# EasyEDA Pro project LisaFPGA Rev 2 EasyEDA Project.epro, schematic LisaFPGA Schematic, sheet 1 of 8

## Sheets
1 Power and USB Input: Board Name: LisaFPGA; Create Date: 2025-10-14; Page Name: Power and USB Input; Project Name: LisaFPGA; Schematic Name: LisaFPGA Schematic; Update Date: 2026-01-04; Company: EasyEDA.com; Page Size: A4; Version: V1.0
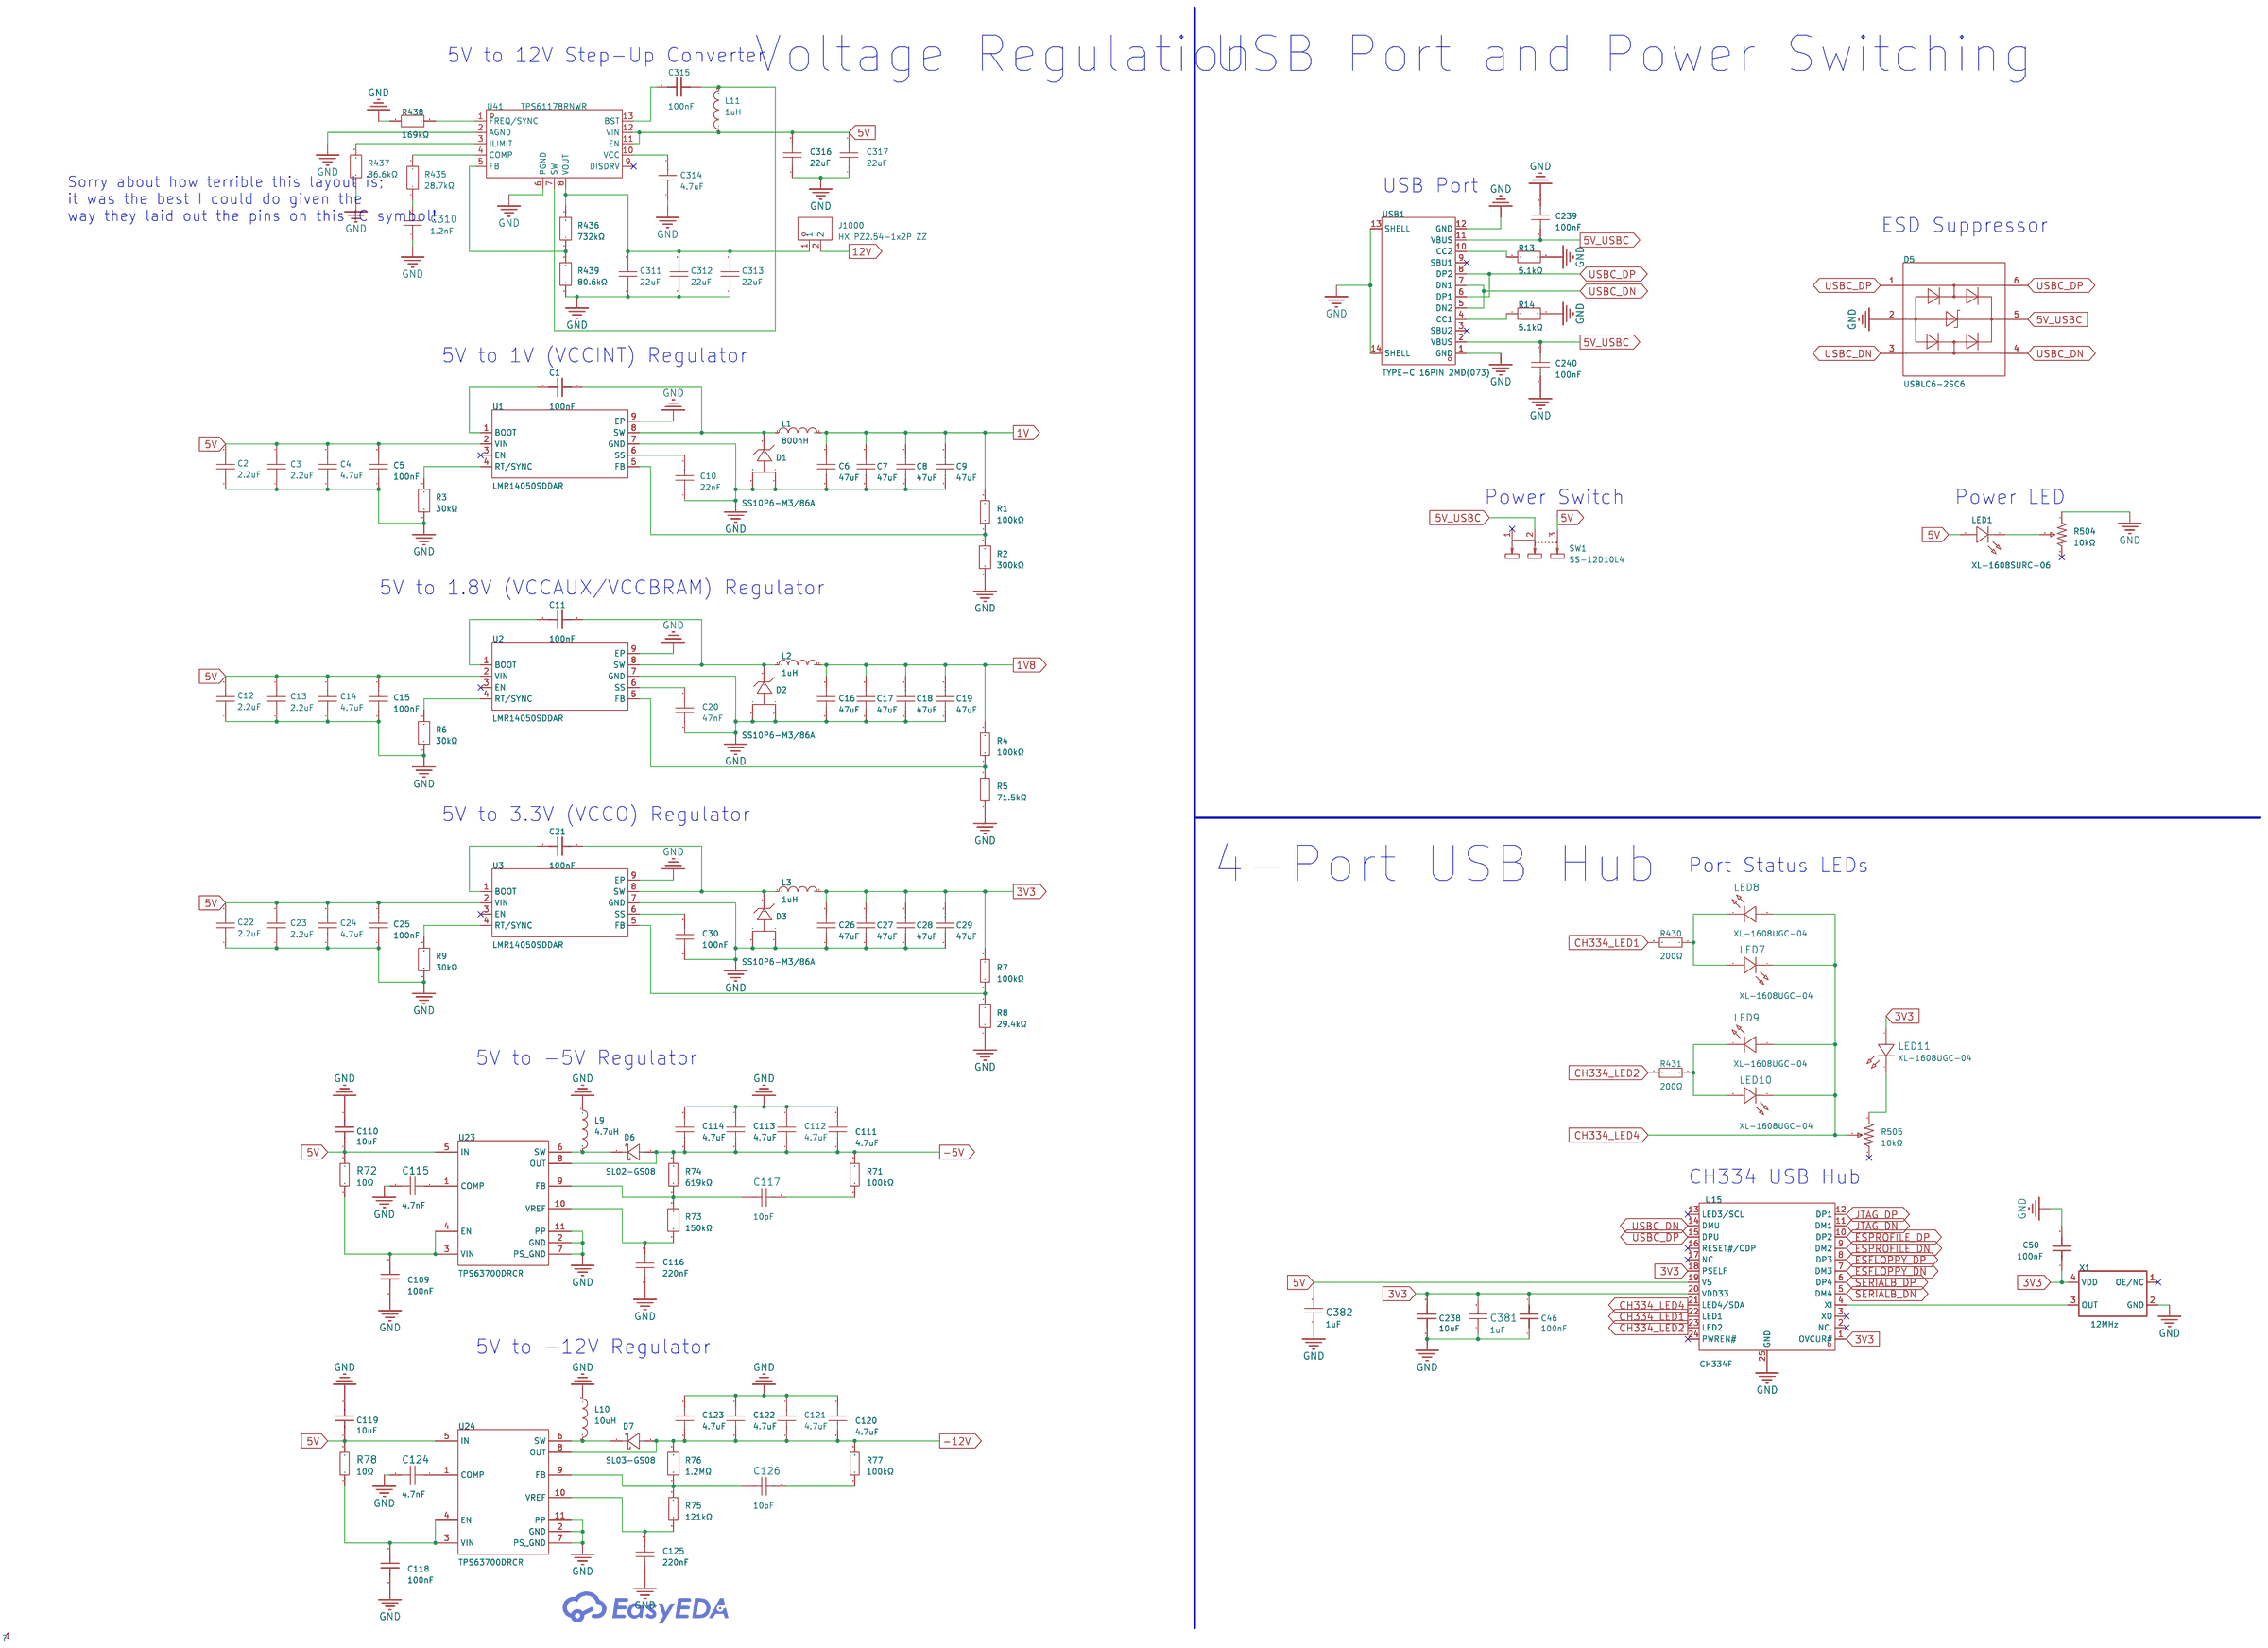
[diagram p1: Power and USB Input]

## Parts
C1  100nF  [C0402]
C2  2.2uF  [C1206]
C3  2.2uF  [C1206]
C4  4.7uF  [C0603]
C5  100nF  [C0805]
C6  47uF  [C1210]
C7  47uF  [C1210]
C8  47uF  [C1210]
C9  47uF  [C1210]
C10  22nF  [C0603]
C11  100nF  [C0402]
C12  2.2uF  [C1206]
C13  2.2uF  [C1206]
C14  4.7uF  [C0603]
C15  100nF  [C0805]
C16  47uF  [C1210]
C17  47uF  [C1210]
C18  47uF  [C1210]
C19  47uF  [C1210]
C20  47nF  [C0603]
C21  100nF  [C0402]
C22  2.2uF  [C1206]
C23  2.2uF  [C1206]
C24  4.7uF  [C0603]
C25  100nF  [C0805]
C26  47uF  [C1210]
C27  47uF  [C1210]
C28  47uF  [C1210]
C29  47uF  [C1210]
C30  100nF  [C0805]
C46  100nF  [C0402]
C50  100nF  [C0402]
C109  100nF  [C0402]
C110  10uF  [C0603]
C111  4.7uF  [C0603]
C112  4.7uF  [C0603]
C113  4.7uF  [C0603]
C114  4.7uF  [C0603]
C115  4.7nF  [C0402]
C116  220nF  [C0402]
C117  10pF  [C0402]
C118  100nF  [C0402]
C119  10uF  [C0603]
C120  4.7uF  [C0603]
C121  4.7uF  [C0603]
C122  4.7uF  [C0603]
C123  4.7uF  [C0603]
C124  4.7nF  [C0402]
C125  220nF  [C0402]
C126  10pF  [C0402]
C238  10uF  [C0603]
C239  100nF  [C0805]
C240  100nF  [C0805]
C310  1.2nF  [C0402]
C311  22uF  [C0805]
C312  22uF  [C0805]
C313  22uF  [C0805]
C314  4.7uF  [C0603]
C315  100nF  [C0402]
C316  22uF  [C0805]
C317  22uF  [C0805]
C381  1uF  [C0402]
C382  1uF  [C0402]
D1  SS10P6-M3/86A  [TO-277A_L6.1-W4.6-P2.13-LS6.5-TR]
D2  SS10P6-M3/86A  [TO-277A_L6.1-W4.6-P2.13-LS6.5-TR]
D3  SS10P6-M3/86A  [TO-277A_L6.1-W4.6-P2.13-LS6.5-TR]
D5  USBLC6-2SC6  [SOT-23-6_L2.9-W1.6-P0.95-LS2.8-BL]
D6  SL02-GS08  [SOD-123_L2.7-W1.8-LS3.7-RD]
D7  SL03-GS08  [SMF_L2.8-W1.8-LS3.7-RD]
J1000  HX PZ2.54-1x2P ZZ  [HDR-TH_2P-P2.54-V-M-3]
L1  800nH  [IND-SMD_L11.5-W10.0_FXL1040]
L2  1uH  [IND-SMD_L7.0-W6.6]
L3  1uH  [IND-SMD_L7.0-W6.6]
L9  4.7uH  [IND-SMD_L4.5-W4.2]
L10  10uH  [IND-SMD_L4.0-W4.0_FNR40XXS]
L11  1uH  [IND-SMD_L7.0-W6.6]
LED1  XL-1608SURC-06  [LED0603-RD_RED]
LED7  XL-1608UGC-04  [LED0603-RD_GREEN]
LED8  XL-1608UGC-04  [LED0603-RD_GREEN]
LED9  XL-1608UGC-04  [LED0603-RD_GREEN]
LED10  XL-1608UGC-04  [LED0603-RD_GREEN]
LED11  XL-1608UGC-04  [LED0603-RD_GREEN]
R1  100kΩ  [R0603]
R2  300kΩ  [R0603]
R3  30kΩ  [R0603]
R4  100kΩ  [R0603]
R5  71.5kΩ  [R0603]
R6  30kΩ  [R0603]
R7  100kΩ  [R0603]
R8  29.4kΩ  [R0603]
R9  30kΩ  [R0603]
R13  5.1kΩ  [R0603]
R14  5.1kΩ  [R0603]
R71  100kΩ  [R0603]
R72  10Ω  [R0603]
R73  150kΩ  [R0402]
R74  619kΩ  [R0402]
R75  121kΩ  [R0402]
R76  1.2MΩ  [R0402]
R77  100kΩ  [R0603]
R78  10Ω  [R0603]
R430  200Ω  [R0402]
R431  200Ω  [R0402]
R435  28.7kΩ  [R0402]
R436  732kΩ  [R0603]
R437  86.6kΩ  [R0402]
R438  169kΩ  [R0402]
R439  80.6kΩ  [R0603]
R504  10kΩ  [RES-ADJ-SMD_3P-L3.0-W3.8-P1.75-BR]
R505  10kΩ  [RES-ADJ-SMD_3P-L3.0-W3.8-P1.75-BR]
SW1  SS-12D10L4  [SW-TH_SS-12D10L3]
U1  LMR14050SDDAR  [SOIC-8_L4.9-W3.9-P1.27-LS6.0-BL-EP]
U2  LMR14050SDDAR  [SOIC-8_L4.9-W3.9-P1.27-LS6.0-BL-EP]
U3  LMR14050SDDAR  [SOIC-8_L4.9-W3.9-P1.27-LS6.0-BL-EP]
U15  CH334F  [QFN-24_L4.0-W4.0-P0.50-BL-EP2.8]
U23  TPS63700DRCR  [VSON-10_L3.0-W3.0-P0.50-TL-EP]
U24  TPS63700DRCR  [VSON-10_L3.0-W3.0-P0.50-TL-EP]
U41  TPS61178RNWR  [VQFN-HR-13_L3.0-W3.5-P0.50-BL]
USB1  TYPE-C 16PIN 2MD(073)  [USB-C-SMD_TYPE-C-6PIN-2MD-073]
X1  12MHz  [OSC-SMD_4P-L3.2-W2.5-BL]

## Library data of the parts
C1 C11 C21 C46 C50 C109 C118 C315 = 100nF: Supplier: LCSC; Supplier Part: C343042; Manufacturer: TDK; Manufacturer Part: CGA2B3X7R1H104KT0Y0F; JLCPCB Part Class: Extended Part; nameAlias: Value; Contributor: LCSC; spicePre: C; spiceSymbolName: CGA2B3X7R1H104KT0Y0F
C2 C3 C12 C13 C22 C23 = CL31B225KCHSNNE: Capacitance:2.2uF Tolerance:±10% Tolerance:±10% Voltage Rating:100V Temperature Coefficient:X7R; LCSC Part Name: 2.2uF ±10% 100V; Supplier Part: C170101; Manufacturer: SAMSUNG(三星); Supplier Footprint: 1206; JLCPCB Part Class: Extended Part; Datasheet: https://item.szlcsc.com/datasheet/CL31B225KCHSNNE/181486.html; Supplier: LCSC; Tolerance: ±10%; Voltage Rating: 100V; Temperature Coefficient: X7R
C4 C14 C24 C111-C114 C120-C123 C314 = CL10A475KO8NNNC: Capacitance:4.7uF Tolerance:±10% Tolerance:±10% Voltage Rating:16V Temperature Coefficient:X5R; LCSC Part Name: 4.7uF ±10% 16V; Supplier Part: C19666; Manufacturer: SAMSUNG(三星); Supplier Footprint: 0603; JLCPCB Part Class: Basic Part; Datasheet: https://item.szlcsc.com/datasheet/CL10A475KO8NNNC/20375.html; Supplier: LCSC; Tolerance: ±10%; Voltage Rating: 16V; Temperature Coefficient: X5R
C5 C15 C25 C30 C239 C240 = C0805B104K500NT: Capacitance:100nF Tolerance:±10% Tolerance:±10% Voltage Rating:50V Temperature Coefficient:X7R; LCSC Part Name: 100nF ±10% 50V; Supplier Part: C476766; Manufacturer: TORCH(火炬); Supplier Footprint: 0805; JLCPCB Part Class: Extended Part; Datasheet: https://item.szlcsc.com/datasheet/C0805B104K500NT/483556.html; Supplier: LCSC; Tolerance: ±10%; Voltage Rating: 50V; Temperature Coefficient: X7R
C6-C9 C16-C19 C26-C29 = CS3225X7R476K160NRL: Capacitance:47uF Tolerance:±10% Tolerance:±10% Voltage Rating:16V Temperature Coefficient:X7R; LCSC Part Name: 47uF ±10% 16V; Supplier Part: C5440143; Manufacturer: SAMWHA(三和); Supplier Footprint: 1210; JLCPCB Part Class: Extended Part; Datasheet: https://atta.szlcsc.com/upload/public/pdf/source/20241120/90C342CED6A4517481676783052A38A7.pdf; Supplier: LCSC; Tolerance: ±10%; Voltage Rating: 16V; Temperature Coefficient: X7R
C10 = CGA3E3X8R2A223KT0Y0N: Capacitance:22nF Tolerance:±10% Tolerance:±10% Voltage Rating:100V Temperature Coefficient:X8R; LCSC Part Name: 22nF ±10% 100V; Supplier Part: C5139510; Manufacturer: TDK; Supplier Footprint: 0603; JLCPCB Part Class: Extended Part; Datasheet: https://item.szlcsc.com/datasheet/CGA3E3X8R2A223KT0Y0N/5751593.html; Supplier: LCSC; Tolerance: ±10%; Voltage Rating: 100V; Temperature Coefficient: X8R
C20 = TCC0603X7R473M500CT: Capacitance:47nF Tolerance:±20% Tolerance:±20% Voltage Rating:50V Temperature Coefficient:X7R; LCSC Part Name: 47nF ±20% 50V; Supplier Part: C696860; Manufacturer: CCTC(三环); Supplier Footprint: 0603; JLCPCB Part Class: Extended Part; Datasheet: https://item.szlcsc.com/datasheet/TCC0603X7R473M500CT/730944.html; Supplier: LCSC; Tolerance: ±20%; Voltage Rating: 50V; Temperature Coefficient: X7R
C110 C119 C238 = 10uF: Supplier: LCSC; Supplier Part: C2936601; Manufacturer: YAGEO(国巨); Manufacturer Part: CC0603KRX5R7BB106; JLCPCB Part Class: Extended Part; nameAlias: Value; Contributor: lcsc; spicePre: C; spiceSymbolName: CC0603KRX5R7BB106
C115 C124 = CL05B472KB5NNNC: Capacitance:4.7nF Tolerance:±10% Tolerance:±10% Voltage Rating:50V Temperature Coefficient:X7R; LCSC Part Name: 4.7nF ±10% 50V; Supplier Part: C84705; Manufacturer: SAMSUNG(三星); Supplier Footprint: 0402; JLCPCB Part Class: Extended Part; Datasheet: https://item.szlcsc.com/datasheet/CL05B472KB5NNNC/85876.html; Supplier: LCSC; Tolerance: ±10%; Voltage Rating: 50V; Temperature Coefficient: X7R
C116 C125 = 0402X224K250NT: Capacitance:220nF Tolerance:±10% Tolerance:±10% Voltage Rating:25V Temperature Coefficient:X5R; LCSC Part Name: 220nF ±10% 25V; Supplier Part: C2991751; Manufacturer: FH(风华); Supplier Footprint: 0402; JLCPCB Part Class: Extended Part; Datasheet: https://atta.szlcsc.com/upload/public/pdf/source/20200305/C486355_26A10D38EF8C2A5C37091D0039909270.pdf; Supplier: LCSC; Tolerance: ±10%; Voltage Rating: 25V; Temperature Coefficient: X5R
C117 C126 = TCC0402COG100J500AT: Capacitance:10pF Tolerance:±5% Tolerance:±5% Voltage Rating:50V Temperature Coefficient:C0G; LCSC Part Name: 10pF ±5% 50V; Supplier Part: C696913; Manufacturer: CCTC(三环); Supplier Footprint: 0402; JLCPCB Part Class: Extended Part; Datasheet: https://item.szlcsc.com/datasheet/TCC0402COG100J500AT/730997.html; Supplier: LCSC; Tolerance: ±5%; Voltage Rating: 50V; Temperature Coefficient: C0G
C310 = CC0402KRX7R9BB122: Capacitance:1.2nF Tolerance:±10% Tolerance:±10% Voltage Rating:50V Temperature Coefficient:X7R; LCSC Part Name: 1.2nF ±10% 50V; Supplier Part: C107021; Manufacturer: YAGEO(国巨); Supplier Footprint: 0402; JLCPCB Part Class: Extended Part; Datasheet: https://item.szlcsc.com/datasheet/CC0402KRX7R9BB122/108237.html; Supplier: LCSC; Tolerance: ±10%; Voltage Rating: 50V; Temperature Coefficient: X7R
C311-C313 C316 C317 = CL21A226MAYNNNE: Capacitance:22uF Tolerance:±20% Tolerance:±20% Voltage Rating:25V Temperature Coefficient:X5R; LCSC Part Name: 22uF ±20% 25V; Supplier Part: C602037; Manufacturer: SAMSUNG(三星); Supplier Footprint: 0805; JLCPCB Part Class: Extended Part; Datasheet: https://item.szlcsc.com/datasheet/CL21A226MAYNNNE/631473.html; Supplier: LCSC; Tolerance: ±20%; Voltage Rating: 25V; Temperature Coefficient: X5R
C381 C382 = CL05A105KO5NNNC: Capacitance:1uF Tolerance:±10% Tolerance:±10% Voltage Rating:16V Temperature Coefficient:X5R; LCSC Part Name: 1uF ±10% 16V; Supplier Part: C29266; Manufacturer: SAMSUNG(三星); Supplier Footprint: 0402; JLCPCB Part Class: Extended Part; Datasheet: https://item.szlcsc.com/datasheet/CL05A105KO5NNNC/30018.html; Supplier: LCSC; Tolerance: ±10%; Voltage Rating: 16V; Temperature Coefficient: X5R
D1-D3 = SS10P6-M3/86A: Diode Configuration:1 Independent Voltage - Forward(Vf@If):590mV@10A Voltage - DC Reverse(Vr):60V Current - Rectified:10A Reverse Leakage Current (Ir):7.8uA@60V Operating Junction Temperature Range:-55℃~+150℃ Operating Junction Temperature Range:-55℃~+150; LCSC Part Name: 电压:60V 电流:10A; Supplier Part: C2927414; Manufacturer: VISHAY(威世); Supplier Footprint: TO-277A; JLCPCB Part Class: Extended Part; Datasheet: https://item.szlcsc.com/datasheet/SS10P6-M3%252F86A/3254776.html; Supplier: LCSC; Diode Configuration: 1 Independent; Voltage - Forward(Vf@If): 590mV@10A; Voltage - DC Reverse(Vr): 60V; Current - Rectified: 10A; Reverse Leakage Current (Ir): 7.8uA@60V; Operating Junction Temperature Range: -55℃~+150℃; Non-Repetitive Peak Forward Surge Current: 280A
D5 = USBLC6-2SC6_C7519: Polarity:Unidirectional Reverse Stand-Off Voltage (Vrwm):5.25V Clamping Voltage:17V Peak Pulse Current (Ipp):5A Voltage - Breakdown:6V Reverse Leakage Current (Ir):150nA Number of Channels:2 Operating Temperature:-40℃~+125℃ Operating Temperature:-40℃~+125; LCSC Part Name: 单向ESD; Supplier Part: C7519; Manufacturer: ST(意法半导体); Supplier Footprint: SOT-23-6L; JLCPCB Part Class: Extended Part; Datasheet: https://item.szlcsc.com/datasheet/USBLC6-2SC6/7996.html; Supplier: LCSC; Polarity: Unidirectional; Reverse Stand-Off Voltage (Vrwm): 5.25V; Clamping Voltage: 17V; Peak Pulse Current (Ipp): 5A; Voltage - Breakdown: 6V; Reverse Leakage Current (Ir): 150nA; Number of Channels: 2; Operating Temperature: -40℃~+125℃; level of protection: IEC 61000-4-2; Type: ESD; Junction Capacitance: 3.5pF
D6 = SL02-GS08_C7422632: Diode Configuration:Independent Voltage - Forward(Vf@If):380mV@1A Voltage - DC Reverse(Vr):30V Current - Rectified:1A Reverse Leakage Current (Ir):200uA@20V Operating Junction Temperature Range:-55℃~+125℃ Operating Junction Temperature Range:-55℃~+125℃ No; LCSC Part Name: 电压:30V 电流:1A; Supplier Part: C7422632; Manufacturer: FUXINSEMI(富芯森美); Supplier Footprint: SOD-123; JLCPCB Part Class: Extended Part; Datasheet: https://item.szlcsc.com/datasheet/SL02-GS08/8405503.html; Supplier: LCSC; Diode Configuration: Independent; Voltage - Forward(Vf@If): 380mV@1A; Voltage - DC Reverse(Vr): 30V; Current - Rectified: 1A; Reverse Leakage Current (Ir): 200uA@20V; Operating Junction Temperature Range: -55℃~+125℃; Non-Repetitive Peak Forward Surge Current: 40A
D7 = SL03-GS08: Diode Configuration:1 Independent Voltage - Forward(Vf@If):430mV@1.1A Voltage - DC Reverse(Vr):30V Current - Rectified:1.1A Reverse Leakage Current (Ir):130uA@30V Non-Repetitive Peak Forward Surge Current:40A; LCSC Part Name: 电压:30V 电流:1.1A; Supplier Part: C490381; Manufacturer: VISHAY(威世); Supplier Footprint: DO-219AB(SMF); JLCPCB Part Class: Extended Part; Datasheet: https://item.szlcsc.com/datasheet/SL03-GS08/500808.html; Supplier: LCSC; Diode Configuration: 1 Independent; Voltage - Forward(Vf@If): 430mV@1.1A; Voltage - DC Reverse(Vr): 30V; Current - Rectified: 1.1A; Reverse Leakage Current (Ir): 130uA@30V; Non-Repetitive Peak Forward Surge Current: 40A
J1000 = HX PZ2.54-1x2P ZZ: Pin Structure:1x2P Pitch:2.54mm Row Spacing:- Circluar Pins/Square Pins:Pin Header Mounting Type:Through Hole Number of Rows:1 Number of Pins:2P Current Rating:3A Voltage Rating (Max):1kV Length of Mating Pin:6mm Insulation Height:2.5mm Length of End Conn; LCSC Part Name: 1x2P 间距:2.54mm 方针 直插; Supplier Part: C32713268; Manufacturer: hanxia(韩下); Supplier Footprint: 插件,P=2.54mm; JLCPCB Part Class: Extended Part; Datasheet: https://item.szlcsc.com/datasheet/HX%2520PZ2.54-1x2P%2520ZZ/34444548.html; Supplier: LCSC; Pin Structure: 1x2P; Pitch: 2.54mm; Circluar Pins/Square Pins: Pin Header; Mounting Type: Through Hole; Number of Rows: 1; Number of Pins: 2P; Current Rating: 3A; Voltage Rating (Max): 1kV; Length of Mating Pin: 6mm; Insulation Height: 2.5mm; Length of End Connection Pin: 3mm; Contact Material: Brass; Contact Plating: Gold; Operating Temperature: -40℃~+105℃; Color: Black
L1 = FXL1040-R80-M: Inductance:800nH Tolerance:±20% Tolerance:±20% Rated Current: Saturation Current (Isat):29A DC Resistance (DCR): Type:Integrated molded inductor; LCSC Part Name: 800nH ±20% 29A; Supplier Part: C167225; Manufacturer: cjiang(长江微电); Supplier Footprint: SMD,11.5x10mm; JLCPCB Part Class: Extended Part; Datasheet: https://atta.szlcsc.com/upload/public/pdf/source/20240426/3189EA8206330E2108542F9E34E540E7.pdf; Supplier: LCSC; Tolerance: ±20%; Saturation Current (Isat): 29A; Type: Integrated molded inductor
L2 L3 L11 = FXL0630-1R0-M: Inductance:1uH Tolerance:±20% Tolerance:±20% Current Rating:12A Current - Saturation(Isat):15A DC Resistance(DCR):7.4mΩ Type:Molded Inductor; LCSC Part Name: 1uH ±20% 15A; Supplier Part: C167216; Manufacturer: cjiang(长江微电); Supplier Footprint: SMD,7x6.6mm; JLCPCB Part Class: Extended Part; Datasheet: https://item.szlcsc.com/datasheet/FXL0630-1R0-M/178599.html; Supplier: LCSC; Tolerance: ±20%; Current Rating: 12A; Current - Saturation(Isat): 15A; DC Resistance(DCR): 7.4mΩ; Type: Molded Inductor
L9 = PSPMAA0402-4R7M-ANP: Inductance:4.7uH Tolerance:±20% Tolerance:±20% Current Rating:2A Current - Saturation(Isat):3.5A DC Resistance(DCR):110mΩ Ratings:AEC-Q200; LCSC Part Name: 4.7uH ±20% 3.5A; Supplier Part: C436517; Manufacturer: PROD(谱罗德); Supplier Footprint: SMD,4.5x4.1mm; JLCPCB Part Class: Extended Part; Datasheet: https://atta.szlcsc.com/upload/public/pdf/source/20200727/C436517_C43668348D5D68BE929A7D2423D2ED65.pdf; Supplier: LCSC; Tolerance: ±20%; Current Rating: 2A; Current - Saturation(Isat): 3.5A; DC Resistance(DCR): 110mΩ; Ratings: AEC-Q200
L10 = FNR4030S100MT: Inductance:10uH Tolerance:±20% Tolerance:±20% Current Rating:1.6A Current - Saturation(Isat):2.4A DC Resistance(DCR):130mΩ Type:Magnetic Shielded Inductor; LCSC Part Name: 10uH ±20% 2.4A; Supplier Part: C167879; Manufacturer: cjiang(长江微电); Supplier Footprint: SMD,4x4mm; JLCPCB Part Class: Extended Part; Datasheet: https://item.szlcsc.com/datasheet/FNR4030S100MT/179262.html; Supplier: LCSC; Tolerance: ±20%; Current Rating: 1.6A; Current - Saturation(Isat): 2.4A; DC Resistance(DCR): 130mΩ; Type: Magnetic Shielded Inductor
LED1 = XL-1608SURC-06: Lamp Holder Type:- Illumination Color:Red Voltage - Forward(Vf):2.3V Voltage - Forward(Vf):2.3V Power(Watts):50mW Forward Current:20mA Wavelength - Dominant:620nm~630nm Wavelength - Dominant:620nm~630nm Peak Wavelength:625nm Diode Configuration:- Lens Col; LCSC Part Name: 0603红色贴片式发光二极管; Supplier Part: C965799; Manufacturer: XINGLIGHT(成兴光); Supplier Footprint: 0603; JLCPCB Part Class: Extended Part; Datasheet: https://item.szlcsc.com/datasheet/XL-1608SURC-06/1051408.html; Supplier: LCSC; Illumination Color: Red; Voltage - Forward(Vf): 2.3V; Power(Watts): 50mW; Forward Current: 20mA; Wavelength - Dominant: 620nm~630nm; Peak Wavelength: 625nm; Lens Color: Water Clear; Luminous Intensity: 225mcd; Viewing Angle: 120°; Mounting Style: op View Mount; Operating Temperature: -40℃~+85℃
LED7-LED11 = XL-1608UGC-04: Lamp Holder Type:- Illumination Color:Emerald Green Voltage - Forward(Vf):3.3V Voltage - Forward(Vf):3.3V Power(Watts):70mW Forward Current:20mA Wavelength - Dominant:515nm~535nm Wavelength - Dominant:515nm~535nm Peak Wavelength:525nm Diode Configuration:; Supplier Part: C965804; Manufacturer: XINGLIGHT(成兴光); Supplier Footprint: 0603; JLCPCB Part Class: Extended Part; Datasheet: https://item.szlcsc.com/datasheet/XL-1608UGC-04/1051413.html; Supplier: LCSC; Illumination Color: Emerald Green; Voltage - Forward(Vf): 3.3V; Power(Watts): 70mW; Forward Current: 20mA; Wavelength - Dominant: 515nm~535nm; Peak Wavelength: 525nm; Diode Configuration: Discrete Diode; Lens Color: Water Clear; Luminous Intensity: 810mcd; Viewing Angle: 120°; Mounting Style: op View Mount
R1 R4 R7 R71 R77 = RT0603BRD07100KL: Type:Thin Film Resistor Resistance: Tolerance:±0.1% Tolerance:±0.1% Power(Watts): Overload Voltage (Max): Temperature Coefficient:±25ppm/℃ Temperature Coefficient:±25ppm/℃ Operating Temperature Range:-55℃~+155℃ Operating Temperature Range:-55℃~+155℃; LCSC Part Name: 薄膜电阻 100kΩ ±0.1% 100mW; Supplier Part: C122538; Manufacturer: YAGEO(国巨); Supplier Footprint: 0603; JLCPCB Part Class: Extended Part; Datasheet: https://atta.szlcsc.com/upload/public/pdf/source/20170721/C122538_1500619326323834092.pdf; Supplier: LCSC; Type: Thin Film Resistor; Tolerance: ±0.1%; Temperature Coefficient: ±25ppm/℃; Operating Temperature Range: -55℃~+155℃
R2 = RT0603BRD07300KL: Type:Thin Film Resistor Resistance:300kΩ Tolerance:±0.1% Tolerance:±0.1% Power(Watts):100mW Voltage-Supply(Max):75V Temperature Coefficient:±25ppm/℃ Temperature Coefficient:±25ppm/℃ Operating Temperature:-55℃~+155℃ Operating Temperature:-55℃~+155℃; LCSC Part Name: 薄膜电阻 300kΩ ±0.1% 100mW; Supplier Part: C705762; Manufacturer: YAGEO(国巨); Supplier Footprint: 0603; JLCPCB Part Class: Extended Part; Datasheet: https://item.szlcsc.com/datasheet/RT0603BRD07300KL/742282.html; Supplier: LCSC; Type: Thin Film Resistor; Tolerance: ±0.1%; Power(Watts): 100mW; Voltage-Supply(Max): 75V; Temperature Coefficient: ±25ppm/℃; Operating Temperature: -55℃~+155℃
R3 R6 R9 = RT0603BRD0730KL: Type:Thin Film Resistor Resistance:30kΩ Tolerance:±0.1% Tolerance:±0.1% Power(Watts):100mW Temperature Coefficient:±25ppm/℃ Temperature Coefficient:±25ppm/℃ Operating Temperature:-55℃~+155℃ Operating Temperature:-55℃~+155℃; LCSC Part Name: 薄膜电阻 30kΩ ±0.1% 100mW; Supplier Part: C723585; Manufacturer: YAGEO(国巨); Supplier Footprint: 0603; JLCPCB Part Class: Extended Part; Datasheet: https://item.szlcsc.com/datasheet/RT0603BRD0730KL/768276.html; Supplier: LCSC; Type: Thin Film Resistor; Tolerance: ±0.1%; Power(Watts): 100mW; Temperature Coefficient: ±25ppm/℃; Operating Temperature: -55℃~+155℃
R5 = ERA3AEB7152V: Type:Thin Film Resistor Resistance:71.5kΩ Tolerance:±0.1% Tolerance:±0.1% Power(Watts):100mW Voltage-Supply(Max):75V Temperature Coefficient:±25ppm/℃ Temperature Coefficient:±25ppm/℃ Operating Temperature:-55℃~+155℃ Operating Temperature:-55℃~+155℃; LCSC Part Name: 薄膜电阻 71.5kΩ ±0.1% 100mW; Supplier Part: C278547; Manufacturer: PANASONIC(松下); Supplier Footprint: 0603; JLCPCB Part Class: Extended Part; Datasheet: https://item.szlcsc.com/datasheet/ERA3AEB7152V/265714.html; Supplier: LCSC; Type: Thin Film Resistor; Tolerance: ±0.1%; Power(Watts): 100mW; Voltage-Supply(Max): 75V; Temperature Coefficient: ±25ppm/℃; Operating Temperature: -55℃~+155℃
R8 = FRC0603F2942TS: Type:Thick Film Resistor Resistance:29.4kΩ Tolerance:±1% Tolerance:±1% Power(Watts):100mW Voltage-Supply(Max):75V Temperature Coefficient:±100ppm/℃ Temperature Coefficient:±100ppm/℃ Operating Temperature:-55℃~+155℃ Operating Temperature:-55℃~+155℃; LCSC Part Name: 29.4kΩ ±1% 100mW 厚膜电阻; Supplier Part: C2930086; Manufacturer: FOJAN(富捷); Supplier Footprint: 0603; JLCPCB Part Class: Extended Part; Supplier: LCSC; Type: Thick Film Resistor; Tolerance: ±1%; Power(Watts): 100mW; Voltage-Supply(Max): 75V; Temperature Coefficient: ±100ppm/℃; Operating Temperature: -55℃~+155℃
R13 R14 = FRC0603F5101TS: Type:Thick Film Resistor Resistance:5.1kΩ Tolerance:±1% Tolerance:±1% Power(Watts):100mW Voltage-Supply(Max):75V Temperature Coefficient:±100ppm/℃ Temperature Coefficient:±100ppm/℃ Operating Temperature:-55℃~+155℃ Operating Temperature:-55℃~+155℃; LCSC Part Name: 5.1kΩ ±1% 100mW 厚膜电阻; Supplier Part: C2907044; Manufacturer: FOJAN(富捷); Supplier Footprint: 0603; JLCPCB Part Class: Extended Part; Supplier: LCSC; Type: Thick Film Resistor; Tolerance: ±1%; Power(Watts): 100mW; Voltage-Supply(Max): 75V; Temperature Coefficient: ±100ppm/℃; Operating Temperature: -55℃~+155℃
R72 R78 = 0603WAF100JT5E: Type:Thick Film Resistor Resistance:10Ω Tolerance:±1% Tolerance:±1% Power(Watts):100mW Voltage-Supply(Max):75V Temperature Coefficient:±400ppm/℃ Temperature Coefficient:±400ppm/℃ Operating Temperature:-55℃~+155℃ Operating Temperature:-55℃~+155℃; LCSC Part Name: 10Ω ±1% 100mW 厚膜电阻; Supplier Part: C22859; Manufacturer: UNI-ROYAL(厚声); Supplier Footprint: 0603; JLCPCB Part Class: Basic Part; Datasheet: https://item.szlcsc.com/datasheet/0603WAF100JT5E/23586.html; Supplier: LCSC; Type: Thick Film Resistor; Tolerance: ±1%; Power(Watts): 100mW; Voltage-Supply(Max): 75V; Temperature Coefficient: ±400ppm/℃; Operating Temperature: -55℃~+155℃
R73 = FRC0402F1503TS: Type:Thick Film Resistor Resistance:150kΩ Tolerance:±1% Tolerance:±1% Power(Watts):62.5mW Voltage-Supply(Max):50V Temperature Coefficient:±100ppm/℃ Temperature Coefficient:±100ppm/℃ Operating Temperature:-55℃~+155℃ Operating Temperature:-55℃~+155℃; LCSC Part Name: 150kΩ ±1% 62.5mW 厚膜电阻; Supplier Part: C2909320; Manufacturer: FOJAN(富捷); Supplier Footprint: 0402; JLCPCB Part Class: Extended Part; Supplier: LCSC; Type: Thick Film Resistor; Tolerance: ±1%; Power(Watts): 62.5mW; Voltage-Supply(Max): 50V; Temperature Coefficient: ±100ppm/℃; Operating Temperature: -55℃~+155℃
R74 = RMS04FT6193: Type:Thick Film Resistor Resistance:619kΩ Tolerance:±1% Tolerance:±1% Power(Watts):62.5mW Voltage-Supply(Max):50V Temperature Coefficient:±100ppm/℃ Temperature Coefficient:±100ppm/℃ Operating Temperature:-55℃~+155℃ Operating Temperature:-55℃~+155℃; LCSC Part Name: 厚膜电阻 619kΩ ±1% 62.5mW 抗硫化; Supplier Part: C208923; Manufacturer: 大毅科技; Supplier Footprint: 0402; JLCPCB Part Class: Extended Part; Datasheet: https://item.szlcsc.com/datasheet/RMS04FT6193/209958.html; Supplier: LCSC; Type: Thick Film Resistor; Tolerance: ±1%; Power(Watts): 62.5mW; Voltage-Supply(Max): 50V; Temperature Coefficient: ±100ppm/℃; Operating Temperature: -55℃~+155℃
R75 = RC0402FR-07121KL: Type:Thick Film Resistor Resistance:121kΩ Tolerance:±1% Tolerance:±1% Power(Watts):62.5mW Voltage-Supply(Max):50V Temperature Coefficient:±100ppm/℃ Temperature Coefficient:±100ppm/℃ Operating Temperature:-55℃~+155℃ Operating Temperature:-55℃~+155℃; LCSC Part Name: 厚膜电阻 121kΩ ±1% 62.5mW; Supplier Part: C112303; Manufacturer: YAGEO(国巨); Supplier Footprint: 0402; JLCPCB Part Class: Extended Part; Datasheet: https://item.szlcsc.com/datasheet/RC0402FR-07121KL/113535.html; Supplier: LCSC; Type: Thick Film Resistor; Tolerance: ±1%; Power(Watts): 62.5mW; Voltage-Supply(Max): 50V; Temperature Coefficient: ±100ppm/℃; Operating Temperature: -55℃~+155℃
R76 = FRC0402F1204TS: Type:Thick Film Resistor Resistance:1.2MΩ Tolerance:±1% Tolerance:±1% Power(Watts):62.5mW Voltage-Supply(Max):50V Temperature Coefficient:±100ppm/℃ Temperature Coefficient:±100ppm/℃ Operating Temperature:-55℃~+155℃ Operating Temperature:-55℃~+155℃; LCSC Part Name: 1.2MΩ ±1% 62.5mW 厚膜电阻; Supplier Part: C2960795; Manufacturer: FOJAN(富捷); Supplier Footprint: 0402; JLCPCB Part Class: Extended Part; Supplier: LCSC; Type: Thick Film Resistor; Tolerance: ±1%; Power(Watts): 62.5mW; Voltage-Supply(Max): 50V; Temperature Coefficient: ±100ppm/℃; Operating Temperature: -55℃~+155℃
R430 R431 = RC0402FR-07200RL: Type:Thick Film Resistor Resistance:200Ω Tolerance:±1% Tolerance:±1% Power(Watts):62.5mW Voltage-Supply(Max):50V Temperature Coefficient:±100ppm/℃ Temperature Coefficient:±100ppm/℃ Operating Temperature:-55℃~+155℃ Operating Temperature:-55℃~+155℃; LCSC Part Name: 厚膜电阻 200Ω ±1% 62.5mW; Supplier Part: C114764; Manufacturer: YAGEO(国巨); Supplier Footprint: 0402; JLCPCB Part Class: Extended Part; Datasheet: https://item.szlcsc.com/datasheet/RC0402FR-07200RL/116008.html; Supplier: LCSC; Type: Thick Film Resistor; Tolerance: ±1%; Power(Watts): 62.5mW; Voltage-Supply(Max): 50V; Temperature Coefficient: ±100ppm/℃; Operating Temperature: -55℃~+155℃
R435 = FRC0402F2872TS: Type:Thick Film Resistor Resistance:28.7kΩ Tolerance:±1% Tolerance:±1% Power(Watts):62.5mW Voltage-Supply(Max):50V Temperature Coefficient:±100ppm/℃ Temperature Coefficient:±100ppm/℃ Operating Temperature:-55℃~+155℃ Operating Temperature:-55℃~+155℃; LCSC Part Name: 28.7kΩ ±1% 62.5mW 厚膜电阻; Supplier Part: C2998072; Manufacturer: FOJAN(富捷); Supplier Footprint: 0402; JLCPCB Part Class: Extended Part; Supplier: LCSC; Type: Thick Film Resistor; Tolerance: ±1%; Power(Watts): 62.5mW; Voltage-Supply(Max): 50V; Temperature Coefficient: ±100ppm/℃; Operating Temperature: -55℃~+155℃
R436 = FRC0603F7323TS: Type:Thick Film Resistor Resistance:732kΩ Tolerance:±1% Tolerance:±1% Power(Watts):100mW Voltage-Supply(Max):75V Temperature Coefficient:±100ppm/℃ Temperature Coefficient:±100ppm/℃ Operating Temperature:-55℃~+155℃ Operating Temperature:-55℃~+155℃; LCSC Part Name: 732kΩ ±1% 100mW 厚膜电阻; Supplier Part: C5159703; Manufacturer: FOJAN(富捷); Supplier Footprint: 0603; JLCPCB Part Class: Extended Part; Supplier: LCSC; Type: Thick Film Resistor; Tolerance: ±1%; Power(Watts): 100mW; Voltage-Supply(Max): 75V; Temperature Coefficient: ±100ppm/℃; Operating Temperature: -55℃~+155℃
R437 = RC0402FR-0786K6L: Type:Thick Film Resistor Resistance:86.6kΩ Tolerance:±1% Tolerance:±1% Power(Watts):62.5mW Voltage-Supply(Max):50V Temperature Coefficient:±100ppm/℃ Temperature Coefficient:±100ppm/℃ Operating Temperature:-55℃~+155℃ Operating Temperature:-55℃~+155℃; LCSC Part Name: 厚膜电阻 86.6kΩ ±1% 62.5mW; Supplier Part: C477807; Manufacturer: YAGEO(国巨); Supplier Footprint: 0402; JLCPCB Part Class: Extended Part; Datasheet: https://item.szlcsc.com/datasheet/RC0402FR-0786K6L/484740.html; Supplier: LCSC; Type: Thick Film Resistor; Tolerance: ±1%; Power(Watts): 62.5mW; Voltage-Supply(Max): 50V; Temperature Coefficient: ±100ppm/℃; Operating Temperature: -55℃~+155℃
R438 = FRC0402F1693TS: Type:Thick Film Resistor Resistance:169kΩ Tolerance:±1% Tolerance:±1% Power(Watts):62.5mW Voltage-Supply(Max):50V Temperature Coefficient:±100ppm/℃ Temperature Coefficient:±100ppm/℃ Operating Temperature:-55℃~+155℃ Operating Temperature:-55℃~+155℃; LCSC Part Name: 169kΩ ±1% 62.5mW 厚膜电阻; Supplier Part: C2974012; Manufacturer: FOJAN(富捷); Supplier Footprint: 0402; JLCPCB Part Class: Extended Part; Supplier: LCSC; Type: Thick Film Resistor; Tolerance: ±1%; Power(Watts): 62.5mW; Voltage-Supply(Max): 50V; Temperature Coefficient: ±100ppm/℃; Operating Temperature: -55℃~+155℃
R439 = FRC0603F8062TS: Type:Thick Film Resistor Resistance:80.6kΩ Tolerance:±1% Tolerance:±1% Power(Watts):100mW Voltage-Supply(Max):75V Temperature Coefficient:±100ppm/℃ Temperature Coefficient:±100ppm/℃ Operating Temperature:-55℃~+155℃ Operating Temperature:-55℃~+155℃; LCSC Part Name: 80.6kΩ ±1% 100mW 厚膜电阻; Supplier Part: C2933260; Manufacturer: FOJAN(富捷); Supplier Footprint: 0603; JLCPCB Part Class: Extended Part; Supplier: LCSC; Type: Thick Film Resistor; Tolerance: ±1%; Power(Watts): 100mW; Voltage-Supply(Max): 75V; Temperature Coefficient: ±100ppm/℃; Operating Temperature: -55℃~+155℃
R504 R505 = TC33X-2-103E: Resistance:10kΩ Tolerance:±25% Tolerance:±25% Voltage Rating:- Power(Watts):150mW Temperature Coefficient:±250ppm/℃ Temperature Coefficient:±250ppm/℃ Number of Turns:; LCSC Part Name: 10kΩ ±25%; Supplier Part: C719176; Manufacturer: BOURNS; Supplier Footprint: SMD-3P,3.8x3.6mm; JLCPCB Part Class: Extended Part; Datasheet: https://item.szlcsc.com/datasheet/TC33X-2-103E/762158.html; Supplier: LCSC; Tolerance: ±25%; Power(Watts): 150mW; Temperature Coefficient: ±250ppm/℃
SW1 = SS-12D10L4: Circuit:SPDT Actuator Style:Rectangular Columnar Termination Style:PC Pin Length:13mm Width:6.8mm Switch Height:6.4mm Mounting Type:Through Hole Actuator Color:Black Current Rating:3A Voltage Rating:125V Life:10,000 Cycles Operating Temperature:-40℃~+85℃; LCSC Part Name: 柄长4mm 直插双档 滑动开关; Supplier Part: C843364; Manufacturer: XKB Connection(中国星坤); Supplier Footprint: 插件,13x6.8mm; JLCPCB Part Class: Extended Part; Datasheet: https://item.szlcsc.com/datasheet/SS-12D10L4/902366.html; Supplier: LCSC; Circuit: SPDT; Actuator Style: Rectangular Columnar; Termination Style: PC Pin; Length: 13mm; Width: 6.8mm; Switch Height: 6.4mm; Mounting Type: Through Hole; Actuator Color: Black; Current Rating: 3A; Voltage Rating: 125V; Life: 10,000 Cycles; Operating Temperature: -40℃~+85℃
U1-U3 = LMR14050SDDAR: Function:Buck Voltage - Supply:4V~40V Voltage - Supply:4V~40V Output Voltage:800mV~28V Output Voltage:800mV~28V Output Current:5A Frequency - Switching:2.5MHz Frequency - Switching:2.5MHz Operating Temperature:-40℃~+125℃@(TJ) Operating Temperature:-40℃~+1; LCSC Part Name: 40V、5A、2.2MHz降压转换器，静态电流40μA; Supplier Part: C155484; Manufacturer: TI(德州仪器); Supplier Footprint: SOIC-8-EP; JLCPCB Part Class: Extended Part; Datasheet: https://www.ti.com/cn/lit/gpn/lmr14050; Supplier: LCSC; Function: Buck; Voltage - Supply: 4V~40V; Output Voltage: 800mV~28V; Output Current: 5A; Frequency - Switching: 2.5MHz; Operating Temperature: -40℃~+125℃@(TJ); Synchronous Rectifier: No; Number of Outputs: 1; Topology: Buck; Quiescent Current: 40uA; Switch tube (built-in/external): Built-In; Output Type: Adjustable
U15 = CH334F_C5187527: type:Hub USB Protocol:USB 2.0 Data Rate:480Mbps Voltage - Supply:5V；3.3V Voltage - Supply:5V；3.3V Operating Temperature:-40℃~+85℃ Operating Temperature:-40℃~+85℃; Supplier Part: C5187527; Manufacturer: WCH(南京沁恒); Supplier Footprint: QFN-24(4x4); JLCPCB Part Class: Extended Part; Datasheet: https://item.szlcsc.com/datasheet/CH334F/5860925.html; Supplier: LCSC; type: Hub; USB Protocol: USB 2.0; Data Rate: 480Mbps; Voltage - Supply: 5V；3.3V; Operating Temperature: -40℃~+85℃
U23 U24 = TPS63700DRCR: Function:Boost type Input Voltage:2.7V~5.5V Input Voltage:2.7V~5.5V Output Voltage:-15V~-2V Output Voltage:-15V~-2V Output Current:360mA Switching Frequency:1.38MHz Switching Frequency:1.38MHz Operating Temperature:-40℃~+125℃@(TJ) Operating Temperature:-4; Supplier Part: C54792; Manufacturer: TI(德州仪器); Supplier Footprint: VSON-10-EP(3x3); JLCPCB Part Class: Extended Part; Datasheet: https://www.ti.com/cn/lit/gpn/tps63700; Supplier: LCSC; Function: Boost type; Input Voltage: 2.7V~5.5V; Output Voltage: -15V~-2V; Output Current: 360mA; Switching Frequency: 1.38MHz; Operating Temperature: -40℃~+125℃@(TJ); Synchronous Rectification: No; Number of Outputs: 1; Topology: Inverted; Switch tube (built-in/external): Built-in
U41 = TPS61178RNWR: Function:Boost Voltage - Supply:2.7V~20V Voltage - Supply:2.7V~20V Output Voltage:4.5V~20V Output Voltage:4.5V~20V Output Current:10A Frequency - Switching:2.2MHz Frequency - Switching:2.2MHz Operating Temperature:-40℃~+125℃@(TJ) Operating Temperature:-40; LCSC Part Name: 20V 10A 全集成同步升压转换器带负载断开控制; Supplier Part: C127918; Manufacturer: TI(德州仪器); Supplier Footprint: VQFN-13-HR(3x3.5); JLCPCB Part Class: Extended Part; Datasheet: https://www.ti.com/cn/lit/gpn/tps61178; Supplier: LCSC; Function: Boost; Voltage - Supply: 2.7V~20V; Output Voltage: 4.5V~20V; Output Current: 10A; Frequency - Switching: 2.2MHz; Operating Temperature: -40℃~+125℃@(TJ); Synchronous Rectifier: Yes; Number of Outputs: 1; Topology: Boost; Quiescent Current: 3uA; Switch tube (built-in/external): Built-in; Output Type: Adjustable
USB1 = TYPE-C 16PIN 2MD(073): Connector Type:Type-C Protocol Standard:- Gender:Female Mounting Type:Surface Mount, Right Angle Number of Contacts:16P Number of Ports:1 Current Rating-Power:3A Voltage Rating:5V Connect-Disconnect Life:5,000 Cycles Supplementary Features:- Center Height; LCSC Part Name: Type-C 母 卧贴; Supplier Part: C2765186; Manufacturer: SHOU HAN(首韩); Supplier Footprint: SMD; JLCPCB Part Class: Extended Part; Datasheet: https://item.szlcsc.com/datasheet/TYPE-C%252016PIN%25202MD(073)/2901843.html; Supplier: LCSC; Connector Type: Type-C; Gender: Female; Mounting Type: Surface Mount, Right Angle; Number of Contacts: 16P; Number of Ports: 1; Current Rating-Power: 3A; Voltage Rating: 5V; Connect-Disconnect Life: 5,000 Cycles; Detection color: Black; Operating Temperature: -25℃~+85℃
X1 = 12MHz: Supplier: LCSC; Supplier Part: C725989; Manufacturer: YXC(扬兴晶振); Manufacturer Part: OT322512MJBA4SL; JLCPCB Part Class: Extended Part; Contributor: lcsc; nameAlias: Value; spicePre: X; spiceSymbolName: OT322512MJBA4SL

## Nets
1V: C6.2 C7.2 C8.2 C9.2 L1.2 R1.2 ; also on sheet 8
1V8: C16.2 C17.2 C18.2 C19.2 L2.2 R4.2 ; also on sheet 2 8
3V3: C26.2 C27.2 C28.2 C29.2 C46.2 C50.1 C238.2 C381.2 L3.2 LED11.2(A) R7.2 U15.1(OVCUR#) U15.18(PSELF) U15.20(VDD33) X1.4(VDD) ; also on sheet 2 3 4 5 6 7 8
5V: C2.2 C3.2 C4.2 C5.2 C12.2 C13.2 C14.2 C15.2 C22.2 C23.2 C24.2 C25.2 C110.1 C119.1 C316.2 C317.2 C382.2 L11.1 LED1.2(A) R72.2 R78.2 SW1.3 U1.2(VIN) U2.2(VIN) U3.2(VIN) U15.19(V5) U23.5(IN) U24.5(IN) U41.11(EN) U41.12(VIN) ; also on sheet 2 3 4 5 6 7
5V_USBC: C239.1 C240.2 D5.5 SW1.2 USB1.2(VBUS) USB1.11(VBUS)
12V: J1000.2 ; also on sheet 4 6
-5V: C111.2 C112.2 C113.2 C114.2 D6.2(A) R71.2 R74.2 U23.8(OUT) ; also on sheet 4
-12V: C120.2 C121.2 C122.2 C123.2 D7.2(A) R76.2 R77.2 U24.8(OUT) ; also on sheet 6
GND: C2.1 C3.1 C4.1 C5.1 C6.1 C7.1 C8.1 C9.1 C10.1 C12.1 C13.1 C14.1 C15.1 C16.1 C17.1 C18.1 C19.1 C20.1 C22.1 C23.1 C24.1 C25.1 C26.1 C27.1 C28.1 C29.1 C30.1 C46.1 C50.2 C109.2 C110.2 C111.1 C112.1 C113.1 C114.1 C115.2 C116.1 C118.2 C119.2 C120.1 C121.1 C122.1 C123.1 C124.2 C125.1 C238.1 C239.2 C240.1 C310.1 C311.1 C312.1 C313.1 C314.1 C316.1 C317.1 C381.1 C382.1 D1.1(A) D1.2(A) D2.1(A) D2.2(A) D3.1(A) D3.2(A) D5.2 L9.1 L10.1 R2.1 R3.2 R5.1 R6.2 R8.1 R9.2 R13.2 R14.2 R437.1 R438.2 R439.1 R504.1 U1.7(GND) U1.9(EP) U2.7(GND) U2.9(EP) U3.7(GND) U3.9(EP) U15.25(GND) U23.2(GND) U23.7(PS_GND) U23.11(PP) U24.2(GND) U24.7(PS_GND) U24.11(PP) U41.2(AGND) U41.6(PGND) USB1.1(GND) USB1.12(GND) USB1.13(SHELL) USB1.14(SHELL) X1.2(GND) ; also on sheet 2 3 4 5 6 7 8
CH334_LED1: R430.2 U15.22(LED1)
CH334_LED2: R431.2 U15.23(LED2)
CH334_LED4: LED7.1(K) LED8.2(A) LED9.2(A) LED10.1(K) R505.2 U15.21(LED4/SDA)
ESFLOPPY_DN: U15.7(DM3) ; also on sheet 4
ESFLOPPY_DP: U15.8(DP3) ; also on sheet 4
ESPROFILE_DN: U15.9(DM2) ; also on sheet 3
ESPROFILE_DP: U15.10(DP2) ; also on sheet 3
JTAG_DN: U15.11(DM1) ; also on sheet 2
JTAG_DP: U15.12(DP1) ; also on sheet 2
SERIALB_DN: U15.5(DM4) ; also on sheet 5
SERIALB_DP: U15.6(DP4) ; also on sheet 5
USBC_DN: D5.3 D5.4 U15.14(DMU) USB1.5(DN2) USB1.7(DN1)
USBC_DP: D5.1 D5.6 U15.15(DPU) USB1.6(DP1) USB1.8(DP2)
$1N7702: R3.1 U1.4(RT/SYNC)
$1N7876: C1.1 D1.3(K) L1.1 U1.8(SW)
$1N8815: R1.1 R2.2 U1.5(FB)
$1N8829: C1.2 U1.1(BOOT)
$1N8853: C10.2 U1.6(SS)
$1N9648: C11.2 U2.1(BOOT)
$1N9657: R6.1 U2.4(RT/SYNC)
$1N9662: C11.1 D2.3(K) L2.1 U2.8(SW)
$1N9679: C20.2 U2.6(SS)
$1N9681: R4.1 R5.2 U2.5(FB)
$1N10358: R9.1 U3.4(RT/SYNC)
$1N10361: C21.2 U3.1(BOOT)
$1N10365: C21.1 D3.3(K) L3.1 U3.8(SW)
$1N10384: C30.2 U3.6(SS)
$1N10386: R7.1 R8.2 U3.5(FB)
$1N12007: R14.1 USB1.4(CC1)
$1N12009: R13.1 USB1.10(CC2)
$1N13217: LED1.1(K) R504.2
$1N22987: C115.1 U23.1(COMP)
$1N23031: C109.1 R72.1 U23.3(VIN) U23.4(EN)
$1N23142: D6.1(C) L9.2 U23.6(SW)
$1N23185: C117.1 R73.2 R74.1 U23.9(FB)
$1N23200: C116.2 R73.1 U23.10(VREF)
$1N23220: C117.2 R71.1
$1N23909: C125.2 R75.1 U24.10(VREF)
$1N23916: C126.1 R75.2 R76.1 U24.9(FB)
$1N23931: C126.2 R77.1
$1N23940: C118.1 R78.1 U24.3(VIN) U24.4(EN)
$1N23956: D7.1(K) L10.2 U24.6(SW)
$1N23961: C124.1 U24.1(COMP)
$1N32028: U15.4(XI) X1.3(OUT)
$1N32631: LED7.2(A) LED8.1(K) R430.1
$1N32638: LED9.1(K) LED10.2(A) R431.1
$1N32873: LED11.1(K) R505.1
$1N48812: R437.2 U41.3(ILIMIT)
$1N48831: C310.2 R435.1
$1N48835: R435.2 U41.4(COMP)
$1N48854: R438.1 U41.1(FREQ/SYNC)
$1N48873: C314.2 U41.10(VCC)
$1N48875: R436.1 R439.2 U41.5(FB)
$1N48967: C311.2 C312.2 C313.2 J1000.1 R436.2 U41.8(VOUT)
$1N48972: C315.2 L11.2 U41.7(SW)
$1N48984: C315.1 U41.13(BST)

Not connected (* = marked no-connect by the designer): R504 3*; R505 3*; SW1 1*; U1 3(EN)*; U2 3(EN)*; U3 3(EN)*; U15 2(NC.)* 3(XO)* 13(LED3/SCL)* 16(RESET#/CDP)* 17(NC)* 24(PWREN#)*; U41 9(DISDRV)*; USB1 3(SBU2)* 9(SBU1)*; X1 1(OE/NC)*

## Notes on the sheets
sheet 1
- 5V to 12V Step-Up Converter
- Voltage Regulation
- USB Port and Power Switching
- USB Port
- Sorry about how terrible this layout is;
  it was the best I could do given the
  way they laid out the pins on this IC symbol!
- ESD Suppressor
- 5V to 1V (VCCINT) Regulator
- Power Switch
- Power LED
- 5V to 1.8V (VCCAUX/VCCBRAM) Regulator
- 5V to 3.3V (VCCO) Regulator
- Port Status LEDs
- 4-Port USB Hub
- 5V to -5V Regulator
- CH334 USB Hub
- 5V to -12V Regulator
